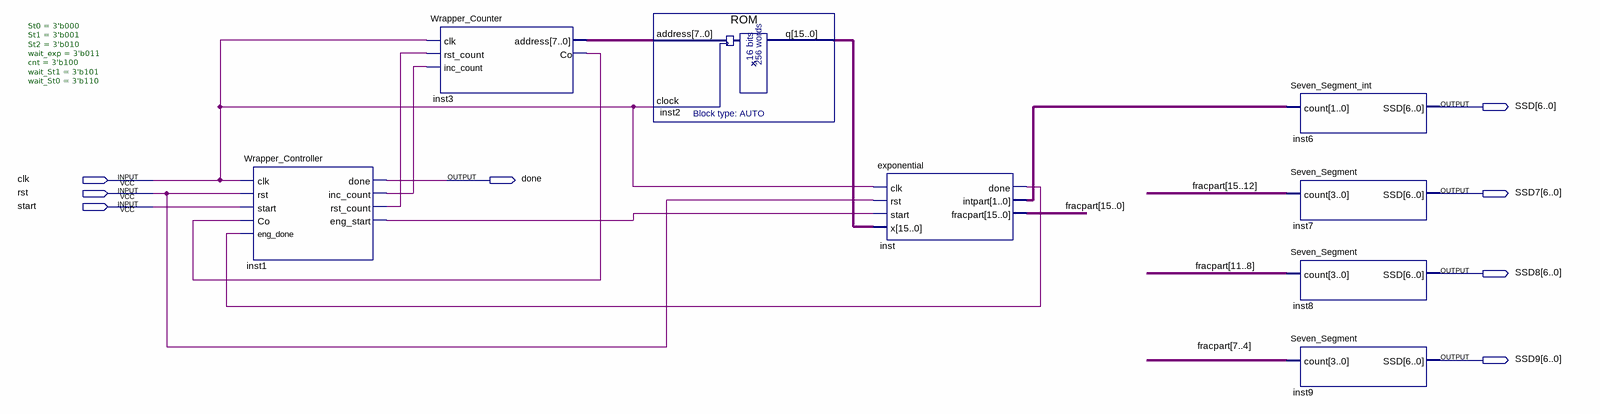
[diagram p0: schematic sheet]
// Quartus schematic Wrapper.bdf as structural Verilog: 8 symbols, 8 pins
module Wrapper (
  input  clk,
  input  rst,
  input  start,
  output [6:0] SSD,
  output done,
  output [6:0] SSD7,
  output [6:0] SSD8,
  output [6:0] SSD9
);

  wire inst1_eng_start, inst1_inc_count, inst1_rst_count, inst3_co, inst_done;
  wire [1:0] inst_intpart;
  wire [7:0] inst3_address;
  wire [15:0] fracpart, inst2_q;

  Wrapper_Controller #(.St0(3'b000), .St1(3'b001), .St2(3'b010), .wait_exp(3'b011), .cnt(3'b100), .wait_St1(3'b101), .wait_St0(3'b110)) inst1 (
    .clk(clk), .rst(rst), .start(start), .Co(inst3_co), .eng_done(inst_done), .done(done),
    .inc_count(inst1_inc_count), .rst_count(inst1_rst_count), .eng_start(inst1_eng_start));
  Wrapper_Counter inst3 (
    .clk(clk), .rst_count(inst1_rst_count), .inc_count(inst1_inc_count), .address(inst3_address),
    .Co(inst3_co));
  ROM inst2 (.address(inst3_address), .clock(clk), .q(inst2_q));
  exponential inst (
    .clk(clk), .rst(rst), .start(inst1_eng_start), .x(inst2_q), .done(inst_done), .intpart(inst_intpart),
    .fracpart(fracpart));
  Seven_Segment_int inst6 (.count(inst_intpart), .SSD(SSD));
  Seven_Segment inst7 (.count(fracpart[15:12]), .SSD(SSD7));
  Seven_Segment inst8 (.count(fracpart[11:8]), .SSD(SSD8));
  Seven_Segment inst9 (.count(fracpart[7:4]), .SSD(SSD9));
endmodule
